# Altium schematic sheet Display.SchDoc
size A
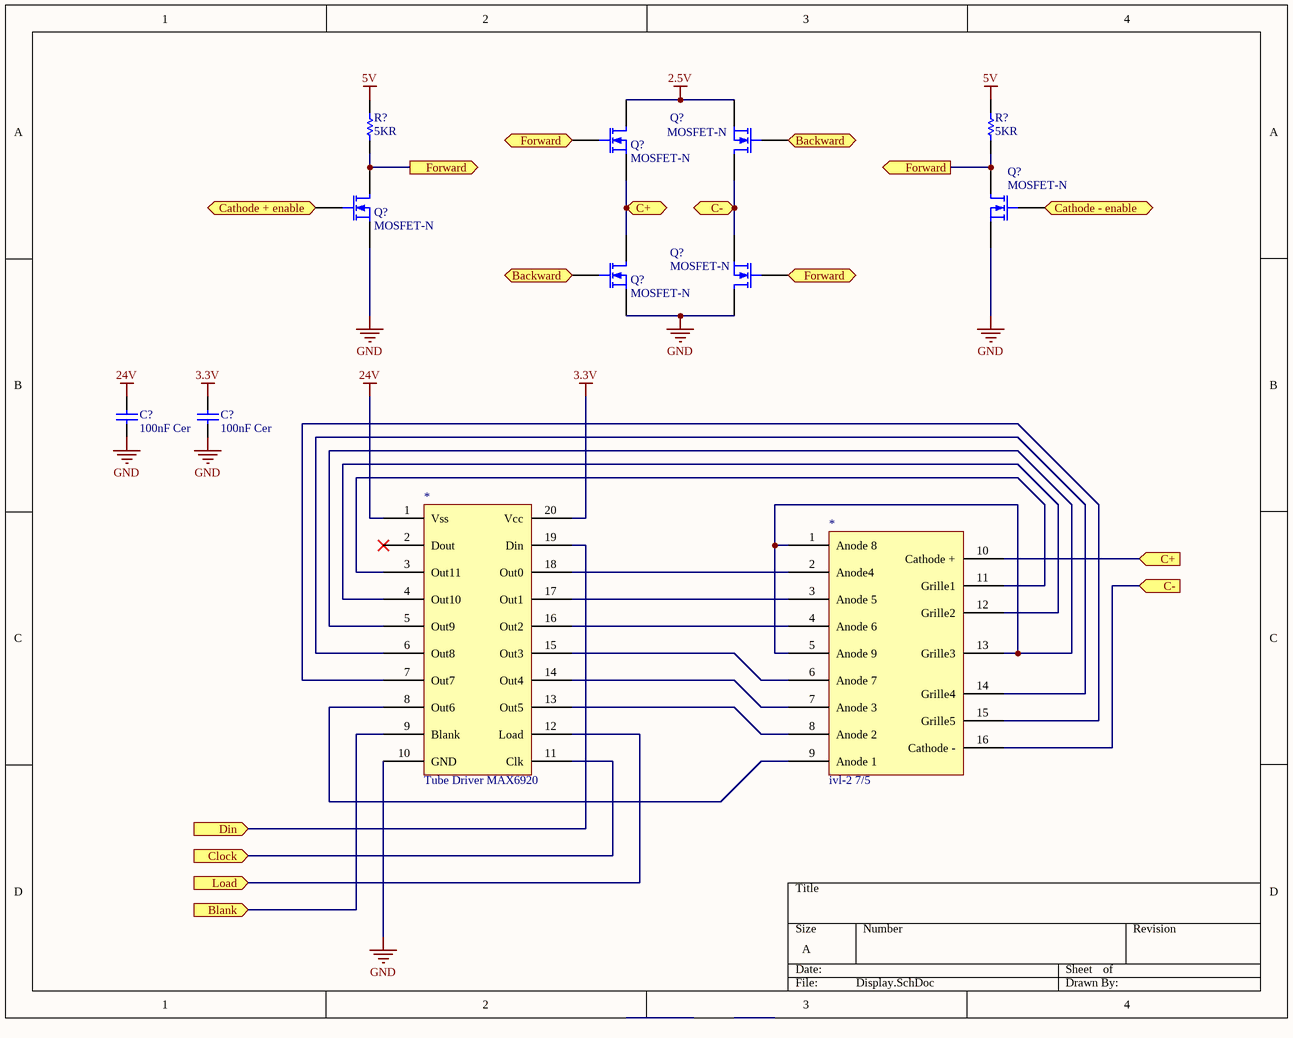
[diagram p0: Display.SchDoc]

## Parts
(Parts that share a designator on the sheet are numbered #1, #2 ... from top to bottom, then left to right.)
*#1  Tube Driver MAX6920
*#2  ivl-2 7/5
C?#1  100nF Cer  [RAD-0.3]
C?#2  100nF Cer  [RAD-0.3]
Q?#1  MOSFET-N  [E3]
Q?#2  MOSFET-N  [E3]
Q?#3  MOSFET-N  [E3]
Q?#4  MOSFET-N  [E3]
Q?#5  MOSFET-N  [E3]
Q?#6  MOSFET-N  [E3]
R?#1  5KR  [AXIAL-0.3]
R?#2  5KR  [AXIAL-0.3]

## Ports
Backward (in), Blank (in), C+ (in), C+ (out), C- (in), C- (out), Cathode + enable (in), Cathode - enable (in), Clock (in), Din (in), Forward (in), Forward (out), Load (in)

## Nets
2.5V: Q?#1.1(D) Q?#2.3(S)
3.3V: *#1.20(Vcc) C?#2.2
5V: R?#1.2 R?#2.2
24V: *#1.1(Vss) C?#1.2
GND: *#1.10(GND) C?#1.1 C?#2.1 Q?#3.3(S) Q?#4.3(S) Q?#5.3(S) Q?#6.1(D)
Backward: Q?#2.2(G) Q?#5.2(G) ; port Backward
Blank: *#1.9(Blank) ; port Blank
C+: *#2.10(Cathode_+) Q?#1.3(S) Q?#5.1(D) ; port C+
C-: *#2.16(Cathode_-) Q?#2.1(D) Q?#6.3(S) ; port C-
Cathode + enable: Q?#3.2(G) ; port Cathode + enable
Cathode - enable: Q?#4.2(G) ; port Cathode - enable
Clock: *#1.11(Clk) ; port Clock
Din: *#1.19(Din) ; port Din
Forward: Q?#1.2(G) Q?#3.1(D) Q?#4.1(D) Q?#6.2(G) R?#1.1 R?#2.1 ; port Forward
Load: *#1.12(Load) ; port Load
Net*#1_3: *#1.3(Out11) *#2.11(Grille1)
Net*#1_4: *#1.4(Out10) *#2.12(Grille2)
Net*#1_5: *#1.5(Out9) *#2.1(Anode_8) *#2.5(Anode_9) *#2.13(Grille3)
Net*#1_6: *#1.6(Out8) *#2.14(Grille4)
Net*#1_7: *#1.7(Out7) *#2.15(Grille5)
Net*#1_8: *#1.8(Out6) *#2.9(Anode_1)
Net*#1_13: *#1.13(Out5) *#2.8(Anode_2)
Net*#1_14: *#1.14(Out4) *#2.7(Anode_3)
Net*#1_15: *#1.15(Out3) *#2.6(Anode_7)
Net*#1_16: *#1.16(Out2) *#2.4(Anode_6)
Net*#1_17: *#1.17(Out1) *#2.3(Anode_5)
Net*#1_18: *#1.18(Out0) *#2.2(Anode4)

Not connected (* = marked no-connect by the designer): *#1 2(Dout)*

## Library data of the parts
C?#1 C?#2 = Cap: Capacitor; Value: 10uF; Published: 8-Jun-2000; LatestRevisionDate: 17-Jul-2002; LatestRevisionNote: Re-released for DXP Platform.; PackageReference: RAD-0.3; Publisher: Altium Limited; PackageDescription: Radial Cap, Thru-Hole; 2 Leads; 0.3 in Pin Spacing
Q?#1-Q?#6 = MOSFET-N: N-Channel MOSFET; Published: 8-Jun-2000; LatestRevisionDate: 17-Jul-2002; LatestRevisionNote: Re-released for DXP Platform.; PackageVersion: 1995/1996; PackageReference: E3; Publisher: Altium Limited; PackageDescription: TO, Flat Index; 3 In-Line, Axial Leads; Body Dia. 4.6mm; Lead Dia. 0.5 mm (max)
R?#1 R?#2 = Res1: Resistor; Value: 1K; Published: 8-Jun-2000; LatestRevisionDate: 17-Jul-2002; LatestRevisionNote: Re-released for DXP Platform.; PackageReference: AXIAL-0.3; Publisher: Altium Limited; PackageDescription: Axial Device, Thru-Hole; 2 Leads; 0.3 in Pin Spacing